# Altium schematic sheet 26DC_20V_REBUILD.SchDoc
size A3; SheetNumber: 1; SheetTotal: 1
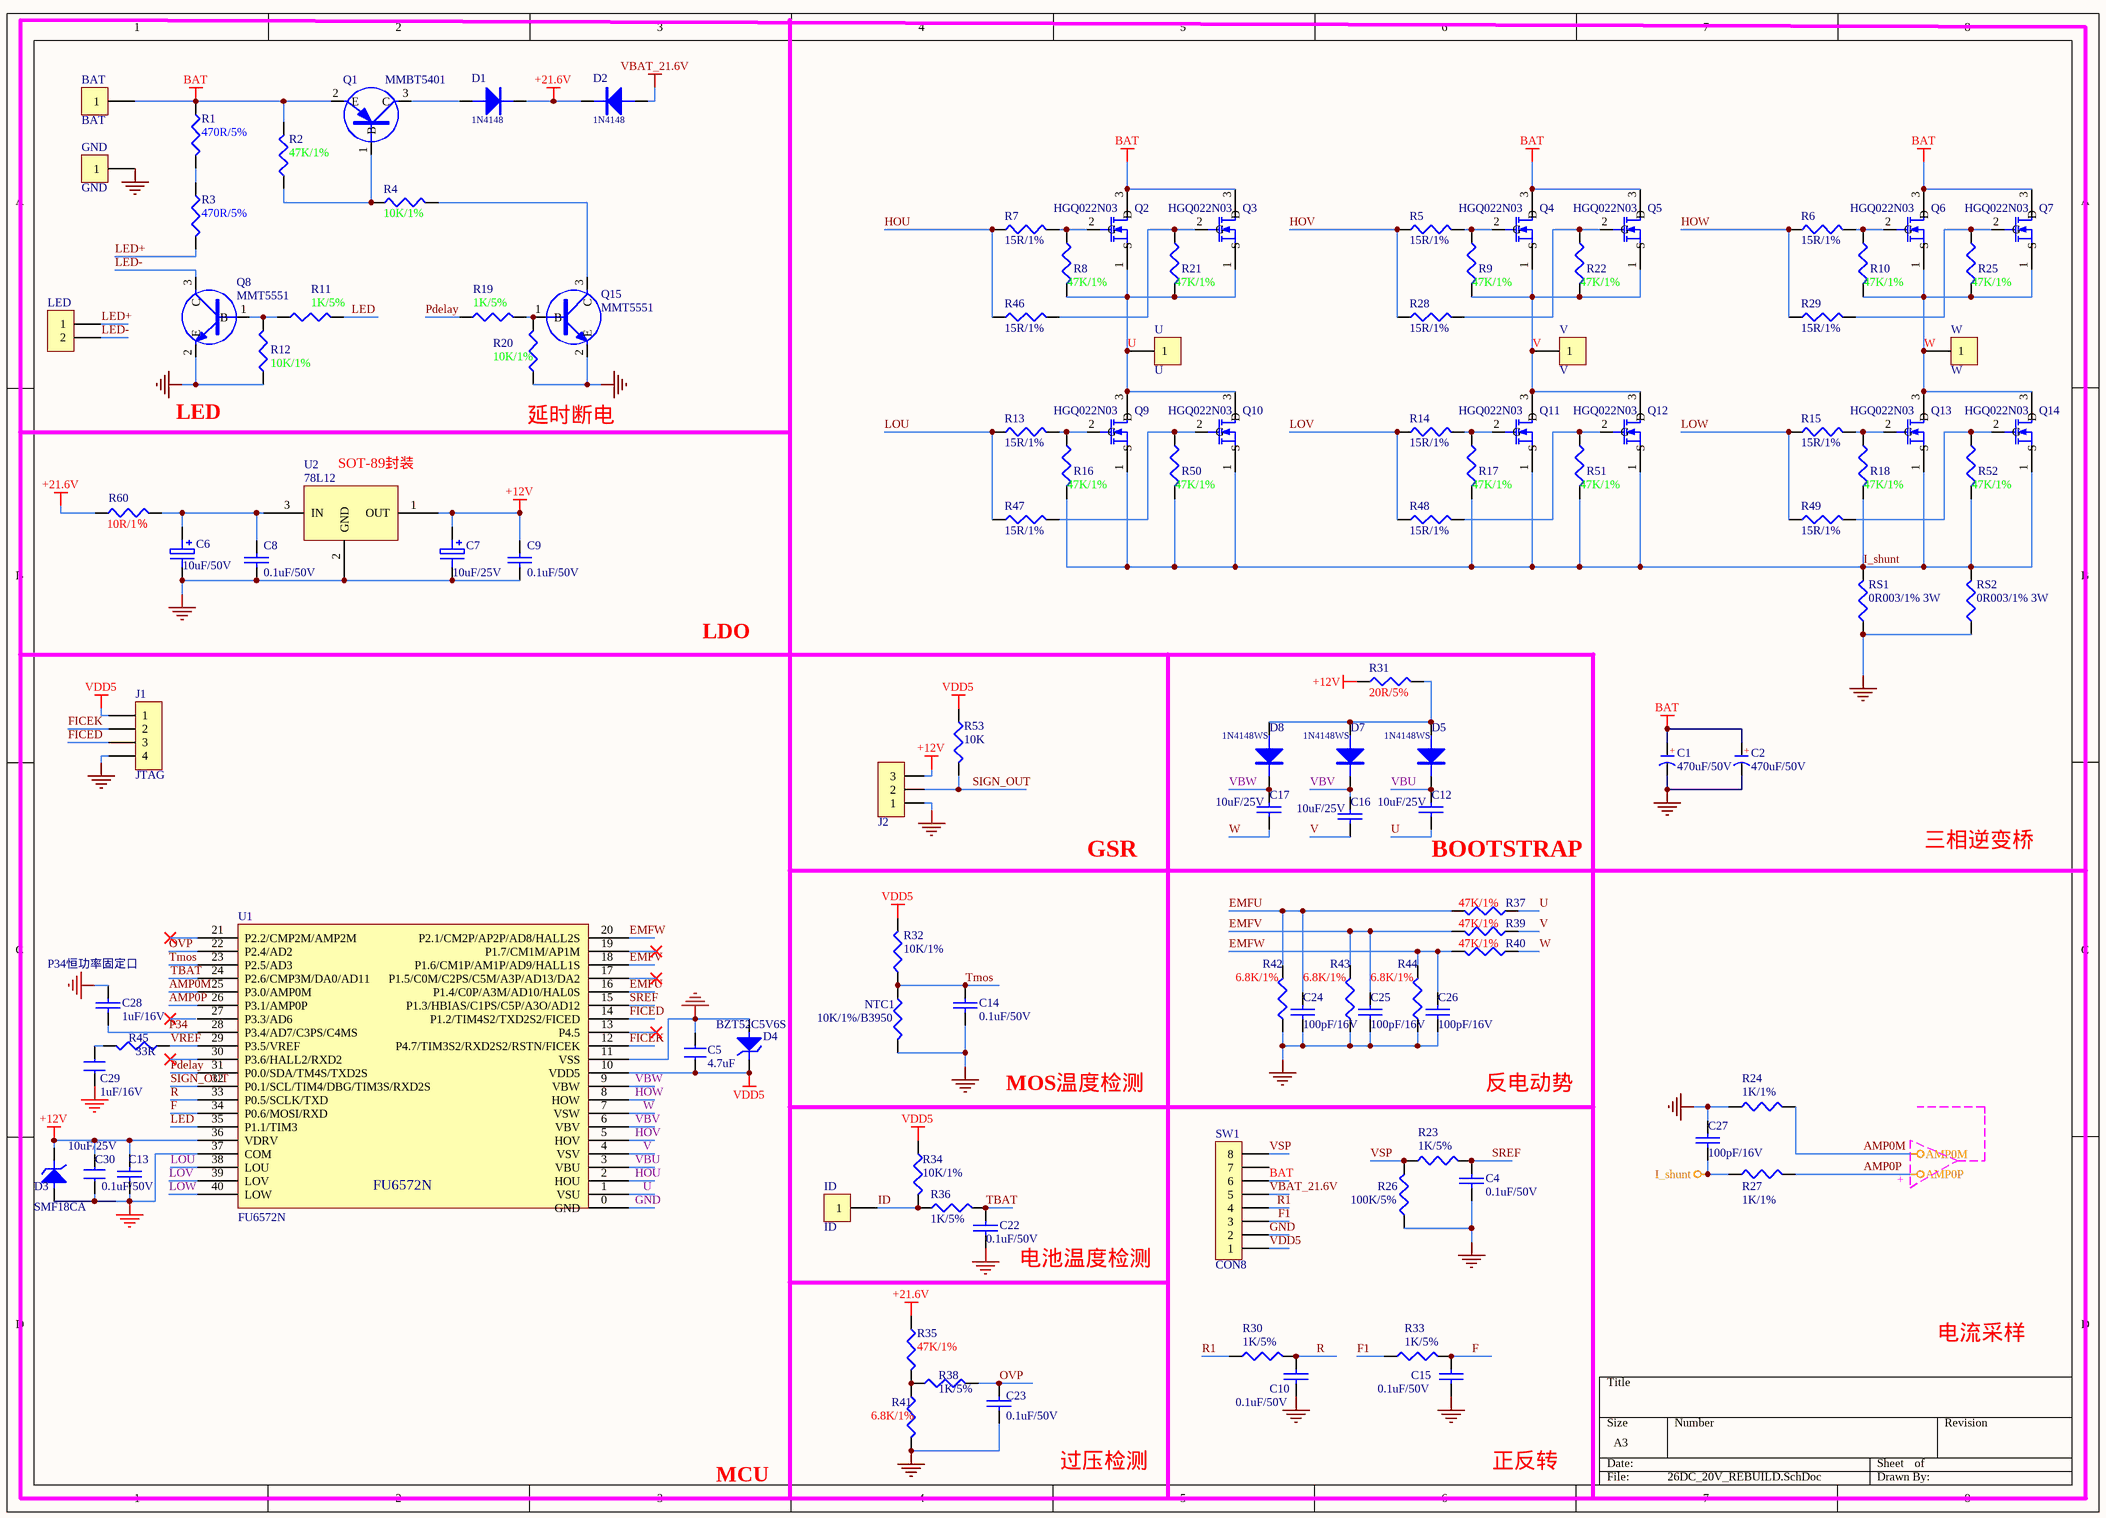
[diagram p0: 26DC_20V_REBUILD.SchDoc]

## Parts
BAT  BAT  [TP]
C1  470uF/50V  [CE-5.0*10*16 - GD]
C2  470uF/50V  [CE-5.0*10*16 - GD]
C4  0.1uF/50V  [C0603]
C5  4.7uF  [C0603]
C6  10uF/50V  [C0805]
C7  10uF/25V  [C0805]
C8  0.1uF/50V  [C0603]
C9  0.1uF/50V  [C0603]
C10  0.1uF/50V  [C0603]
C12  10uF/25V  [C0805]
C13  0.1uF/50V  [C0603]
C14  0.1uF/50V  [C0603]
C15  0.1uF/50V  [C0603]
C16  10uF/25V  [C0805]
C17  10uF/25V  [C0805]
C22  0.1uF/50V  [C0603]
C23  0.1uF/50V  [C0603]
C24  100pF/16V  [C0603]
C25  100pF/16V  [C0603]
C26  100pF/16V  [C0603]
C27  100pF/16V  [C0603]
C28  1uF/16V  [C0603]
C29  1uF/16V  [C0603]
C30  10uF/25V  [C0805]
D1  1N4148  [SOD-123]
D2  1N4148  [SOD-123]
D3  SMF18CA  [SOD-123]
D4  BZT52C5V6S  [SOD-323]
D5  1N4148WS  [SOD-323]
D7  1N4148WS  [SOD-323]
D8  1N4148WS  [SOD-323]
GND  GND  [TP]
ID  ID  [TP]
J1  JTAG  [4p-2.54-Pad]
J2  HDR-1X3_1.25  [CONN-SMD-3P-P1.00_BM03B-SRSS-TB-LF-SN]  (value not drawn)
LED  CONN-SMD_2P-P1.00_HC-1.0-2PLT  [SMD_1.0_2P]  (value not drawn)
NTC1  10K/1%/B3950  [R0603]
Q1  MMBT5401  [SOT-23]
Q2  HGQ022N03  [DFN5*6]
Q3  HGQ022N03  [DFN5*6]
Q4  HGQ022N03  [DFN5*6]
Q5  HGQ022N03  [DFN5*6]
Q6  HGQ022N03  [DFN5*6]
Q7  HGQ022N03  [DFN5*6]
Q8  MMT5551  [SOT-23]
Q9  HGQ022N03  [DFN5*6]
Q10  HGQ022N03  [DFN5*6]
Q11  HGQ022N03  [DFN5*6]
Q12  HGQ022N03  [DFN5*6]
Q13  HGQ022N03  [DFN5*6]
Q14  HGQ022N03  [DFN5*6]
Q15  MMT5551  [SOT-23]
R1  470R/5%  [R1206]
R2  47K/1%  [R0603]
R3  470R/5%  [R1206]
R4  10K/1%  [R0603]
R5  15R/1%  [R0603]
R6  15R/1%  [R0603]
R7  15R/1%  [R0603]
R8  47K/1%  [R0603]
R9  47K/1%  [R0603]
R10  47K/1%  [R0603]
R11  1K/5%  [R0603]
R12  10K/1%  [R0603]
R13  15R/1%  [R0603]
R14  15R/1%  [R0603]
R15  15R/1%  [R0603]
R16  47K/1%  [R0603]
R17  47K/1%  [R0603]
R18  47K/1%  [R0603]
R19  1K/5%  [R0603]
R20  10K/1%  [R0603]
R21  47K/1%  [R0603]
R22  47K/1%  [R0603]
R23  1K/5%  [R0603]
R24  1K/1%  [R0603]
R25  47K/1%  [R0603]
R26  100K/5%  [R0603]
R27  1K/1%  [R0603]
R28  15R/1%  [R0603]
R29  15R/1%  [R0603]
R30  1K/5%  [R0603]
R31  20R/5%  [R1206]
R32  10K/1%  [R0603]
R33  1K/5%  [R0603]
R34  10K/1%  [R0603]
R35  47K/1%  [R0603]
R36  1K/5%  [R0603]
R37  47K/1%  [R0603]
R38  1K/5%  [R0603]
R39  47K/1%  [R0603]
R40  47K/1%  [R0603]
R41  6.8K/1%  [R0603]
R42  6.8K/1%  [R0603]
R43  6.8K/1%  [R0603]
R44  6.8K/1%  [R0603]
R45  33R  [R0603]
R46  15R/1%  [R0603]
R47  15R/1%  [R0603]
R48  15R/1%  [R0603]
R49  15R/1%  [R0603]
R50  47K/1%  [R0603]
R51  47K/1%  [R0603]
R52  47K/1%  [R0603]
R53  10K  [R0603]
R60  10R/1％  [R1206]
RS1  0R003/1% 3W  [R2512]
RS2  0R003/1% 3W  [R2512]
SW1  CON8  [CONN-SMD_8P-P1.00_MEGASTAR_ZX-SH1.0-8PLT]
U  U  [TP]
U1  FU6572N  [QFN40_5*5]
U2  78L12  [SOT-89]
V  V  [TP]
W  W  [TP]

## Nets
+12V: C7.1 C9.1 C13.1 C30.2 D3.2(K) J2.3 R31.1 U1.36(VDRV) U2.1(OUT)
+21.6V: D1.K D2.K R35.1 R60.1
AMP0M: R24.2 U1.25(P3.0/AMP0M)
AMP0P: R27.2 U1.26(P3.1/AMP0P)
BAT: BAT.1 C1.1(A) C2.1(A) Q1.2(E) Q2.3(D) Q3.3(D) Q4.3(D) Q5.3(D) Q6.3(D) Q7.3(D) R1.1 R2.2 SW1.6
GND: C1.2(K) C2.2(K) C4.2 C5.2 C6.2 C7.2 C8.2 C9.2 C10.2 C13.2 C14.2 C15.2 C22.2 C23.2 C24.1 C25.1 C26.1 C27.1 C28.2 C29.1 C30.1 D3.1(A) D4.1(A) GND.1 J1.4 J2.1 NTC1.2 Q8.2(E) Q15.2(E) R12.1 R20.1 R24.1 R26.1 R41.2 R42.1 R43.1 R44.1 RS1.1 RS2.1 SW1.2 U1.0(GND) U1.11(VSS) U1.37(COM) U2.2(GND)
I_shunt: C27.2 Q9.1(S) Q10.1(S) Q11.1(S) Q12.1(S) Q13.1(S) Q14.1(S) R16.2 R17.2 R18.2 R27.1 R50.2 R51.2 R52.2 RS1.2 RS2.2
VBAT_21.6V: D2.A SW1.5
VDD5: C5.1 D4.2(K) J1.1 R32.2 R34.1 R53.1 SW1.1 U1.10(VDD5)
EMFU: C24.2 R37.2 R42.2 U1.16(P1.4/C0P/A3M/AD10/HAL0S)
EMFV: C25.2 R39.2 R43.2 U1.18(P1.6/CM1P/AM1P/AD9/HALL1S)
EMFW: C26.2 R40.2 R44.2 U1.20(P2.1/CM2P/AP2P/AD8/HALL2S)
F: C15.1 R33.2 U1.34(P0.6/MOSI/RXD)
F1: R33.1 SW1.3
FICED: J1.3 U1.14(P1.2/TIM4S2/TXD2S2/FICED)
FICEK: J1.2 U1.12(P4.7/TIM3S2/RXD2S2/RSTN/FICEK)
HOU: R7.1 R46.1 U1.2(HOU)
HOV: R5.1 R28.1 U1.5(HOV)
HOW: R6.1 R29.1 U1.8(HOW)
ID: ID.1 R34.2 R36.1
LED: R11.2 U1.35(P1.1/TIM3)
LED+: LED.1 R3.2
LED-: LED.2 Q8.3(C)
LOU: R13.1 R47.1 U1.38(LOU)
LOV: R14.1 R48.1 U1.39(LOV)
LOW: R15.1 R49.1 U1.40(LOW)
OVP: C23.1 R38.2 U1.22(P2.4/AD2)
P34: C28.1 U1.28(P3.4/AD7/C3PS/C4MS)
Pdelay: R19.1 U1.31(P0.0/SDA/TM4S/TXD2S)
R: C10.1 R30.2 U1.33(P0.5/SCLK/TXD)
R1: R30.1 SW1.4
SIGN_OUT: J2.2 R53.2 U1.32(P0.1/SCL/TIM4/DBG/TIM3S/RXD2S)
SREF: C4.1 R23.2 U1.15(P1.3/HBIAS/C1PS/C5P/A3O/AD12)
TBAT: C22.1 R36.2 U1.24(P2.6/CMP3M/DA0/AD11)
Tmos: C14.1 NTC1.1 R32.1 U1.23(P2.5/AD3)
U: C12.2 Q2.1(S) Q3.1(S) Q9.3(D) Q10.3(D) R8.2 R21.2 R37.1 U.1 U1.1(VSU)
V: C16.1 Q4.1(S) Q5.1(S) Q11.3(D) Q12.3(D) R9.2 R22.2 R39.1 U1.4(VSV) V.1
VBU: C12.1 D5.K U1.3(VBU)
VBV: C16.2 D7.K U1.6(VBV)
VBW: C17.1 D8.K U1.9(VBW)
VREF: R45.1 U1.29(P3.5/VREF)
VSP: R23.1 R26.2 SW1.8
W: C17.2 Q6.1(S) Q7.1(S) Q13.3(D) Q14.3(D) R10.2 R25.2 R40.1 U1.7(VSW) W.1
NetC6_1: C6.1 C8.1 R60.2 U2.3(IN)
NetC29_2: C29.2 R45.2
NetD1_A: D1.A Q1.3(C)
NetD5_A: D5.A D7.A D8.A R31.2
NetQ1_1: Q1.1(B) R2.1 R4.1
NetQ2_2: Q2.2(G) R7.2 R8.1
NetQ3_2: Q3.2(G) R21.1 R46.2
NetQ4_2: Q4.2(G) R5.2 R9.1
NetQ5_2: Q5.2(G) R22.1 R28.2
NetQ6_2: Q6.2(G) R6.2 R10.1
NetQ7_2: Q7.2(G) R25.1 R29.2
NetQ8_1: Q8.1(B) R11.1 R12.2
NetQ9_2: Q9.2(G) R13.2 R16.1
NetQ10_2: Q10.2(G) R47.2 R50.1
NetQ11_2: Q11.2(G) R14.2 R17.1
NetQ12_2: Q12.2(G) R48.2 R51.1
NetQ13_2: Q13.2(G) R15.2 R18.1
NetQ14_2: Q14.2(G) R49.2 R52.1
NetQ15_1: Q15.1(B) R19.2 R20.2
NetQ15_3: Q15.3(C) R4.2
NetR1_2: R1.2 R3.1
NetR35_2: R35.2 R38.1 R41.1

Not connected (* = marked no-connect by the designer): SW1 7; U1 13(P4.5)* 17(P1.5/C0M/C2PS/C5M/A3P/AD13/DA2)* 19(P1.7/CM1M/AP1M)* 21(P2.2/CMP2M/AMP2M)* 27(P3.3/AD6) 30(P3.6/HALL2/RXD2)*

## Notes on the sheet
- LED
- (near R20) 延时断电
- (near U2) SOT-89封装
- LDO
- GSR
- (near C12) BOOTSTRAP
- 三相逆变桥
- (near C28) P34恒功率固定口
- MOS温度检测
- 反电动势
- +
- -
- (near C22) 电池温度检测
- 电流采样
- 过压检测
- 正反转
- MCU
- (in symbol CE) +

## Library data of the parts
BAT = CON1_4: Connector
C1 C2 = CE: 直插电解电容; 淘宝ID: 封装库来自淘宝 ID：黄晶宝石; BOM名称: 直插电解电容; 联系售后: https://item.taobao.com/item.htm?id=566775463719
C4 C10 C13-C15 C22 C23 = CAP-CC: Capacitor
C5 C8 C9 C28-C30 = CAP: Capacitor
C6 = ELECTRO1: Electrolytic Capacitor
C7 = ELECTRO1_1: Electrolytic Capacitor
C12 C16 C17 = CAP-CC(SMD): Capacitor
C24-C27 = CAP_1: Capacitor
D1 D2 D5 D7 D8 = DIODE: pin to pad: A>1 K>2
D3 D4 = TVS1: Zener Diode
GND = CON1_5: Connector
ID U V W = CON1: Connector
J1 = CON4: Connector
J2 = Header 3_1.25: 3P接插件_1.25; BOM名称: 3P接插件; 联系售后: 封装库来自淘宝 ID：黄晶宝石; 学习资源: https://shop463601444.taobao.com
LED = CON2: Connector
NTC1 = RES(SMD)_5
Q1 = PNP
Q8 Q15 = NPN: NPN Transistor
R1 R3 = RES(SMD)_4
R2 R31 R34-R45 R53 = RES(SMD)
R4 R12 R20 R32 = RES(SMD)_3
R5-R7 R13-R15 R28 R29 R46-R49 = RES(SMD)_7
R8-R10 R16-R18 R21 R22 R25 R50-R52 = RES-SMD: RES
R11 R19 R23 R30 R33 = RES(SMD)_2
R24 R27 = RES(SMD)_11
R26 = RES(SMD)_8
R60 = RES(SMD)_9
RS1 RS2 = RES(SMD)_6
SW1 = CON6: Connector
U2 = 78L12-12V